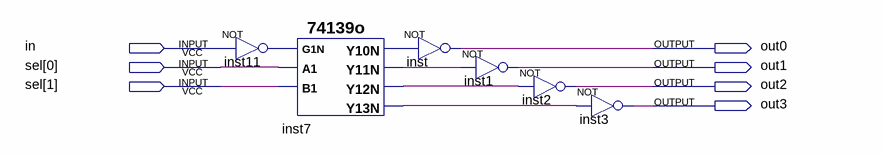
[diagram p0: schematic sheet]
// Quartus schematic 2x4Demultiplexer.bdf as structural Verilog: 6 symbols, 7 pins
module \2x4Demultiplexer  (
  input  in,
  input  [1:0] sel,
  output out0,
  output out1,
  output out2,
  output out3
);

  wire inst7_y10n, inst7_y11n, inst7_y12n, inst7_y13n, inst11_out;

  not inst11 (inst11_out, in);
  \74139o  inst7 (
    .G1N(inst11_out), .A1(sel[0]), .B1(sel[1]), .Y10N(inst7_y10n), .Y11N(inst7_y11n), .Y12N(inst7_y12n),
    .Y13N(inst7_y13n));
  not inst (out0, inst7_y10n);
  not inst1 (out1, inst7_y11n);
  not inst2 (out2, inst7_y12n);
  not inst3 (out3, inst7_y13n);
endmodule
